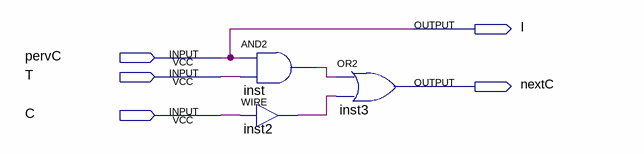
[diagram p0: schematic sheet]
// Quartus schematic ncarry_terminal.bdf as structural Verilog: 3 symbols, 5 pins
module ncarry_terminal (
  input  pervC,
  input  T,
  input  C,
  output I,
  output nextC
);

  wire inst2_out, inst_out;

  and inst (inst_out, pervC, T);
  assign inst2_out = C;  // WIRE inst2
  or inst3 (nextC, inst_out, inst2_out);

  assign I = pervC;
endmodule
